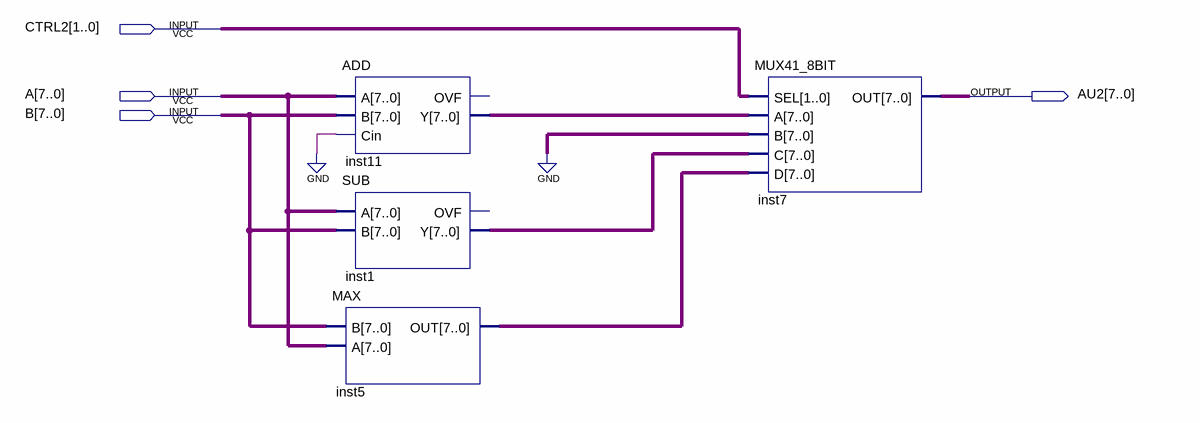
[diagram p0: schematic sheet]
// Quartus schematic AU2.bdf as structural Verilog: 4 symbols, 4 pins
module AU2 (
  input  [1:0] CTRL2,
  input  [7:0] A,
  input  [7:0] B,
  output [7:0] AU2
);

  wire [7:0] inst1_y, inst5_out, inst11_y;

  MAX inst5 (.B(B), .A(A), .OUT(inst5_out));
  ADD inst11 (.A(A), .B(B), .Cin(1'b0), .Y(inst11_y));  // open: OVF
  SUB inst1 (.A(A), .B(B), .Y(inst1_y));  // open: OVF
  MUX41_8BIT inst7 (.SEL(CTRL2), .A(inst11_y), .B({8{1'b0}}), .C(inst1_y), .D(inst5_out), .OUT(AU2));
endmodule
